# Altium schematic sheet BOOST_REG.SchDoc
size C; SheetNumber: 9; SheetTotal: 15
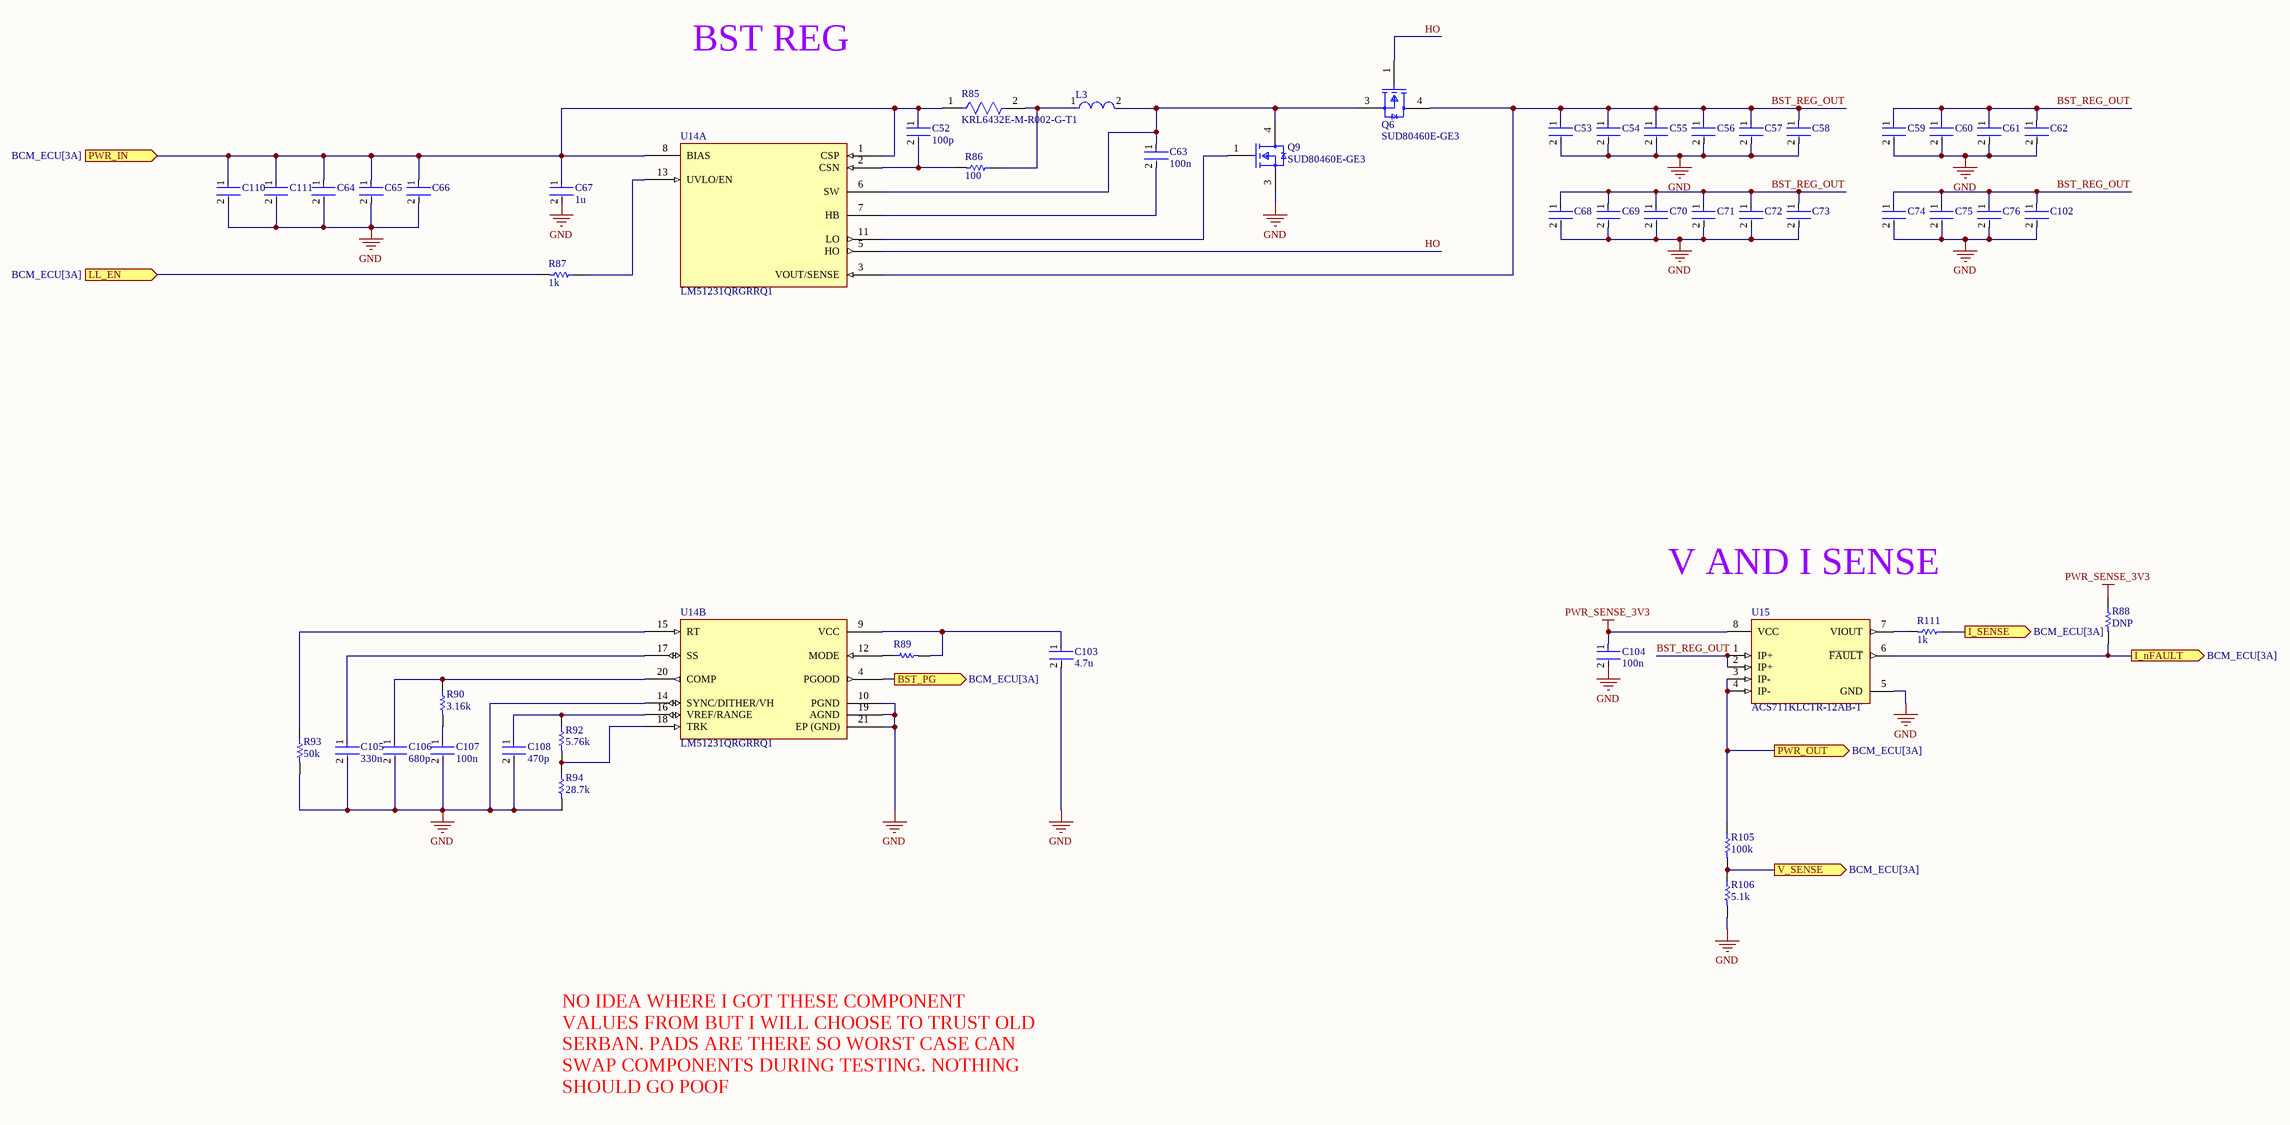
[diagram p0: BOOST_REG.SchDoc]

## Parts
C52  100p  [FP-0402-L_1_0_0_05-W_0_5-IPC_A]
C53  CGA9P3X7S2A156M250KB  [FP-CGA9P-IPC_B]  (value not drawn)
C54  CGA9P3X7S2A156M250KB  [FP-CGA9P-IPC_B]  (value not drawn)
C55  CGA9P3X7S2A156M250KB  [FP-CGA9P-IPC_B]  (value not drawn)
C56  CGA9P3X7S2A156M250KB  [FP-CGA9P-IPC_B]  (value not drawn)
C57  CGA9P3X7S2A156M250KB  [FP-CGA9P-IPC_B]  (value not drawn)
C58  CGA9P3X7S2A156M250KB  [FP-CGA9P-IPC_B]  (value not drawn)
C59  C5750X7R2A335K230KA  [FP-C5750-230-0_4-MFG]  (value not drawn)
C60  C5750X7R2A335K230KA  [FP-C5750-230-0_4-MFG]  (value not drawn)
C61  C5750X7R2A335K230KA  [FP-C5750-230-0_4-MFG]  (value not drawn)
C62  C5750X7R2A335K230KA  [FP-C5750-230-0_4-MFG]  (value not drawn)
C63  100n  [FP-0402-L_1_0_0_05-W_0_5-IPC_A]
C64  CKG57NX5R1H226M500JH  [FP-CKG57N-MFG]  (value not drawn)
C65  CKG57NX5R1H226M500JH  [FP-CKG57N-MFG]  (value not drawn)
C66  HMK325B7105KN-T  [FP-1210-L_3_2_0_3-W_2_5_0-IPC_B]  (value not drawn)
C67  1u  [FP-0402-L_1_0_0_05-W_0_5-IPC_A]
C68  CGA9P3X7S2A156M250KB  [FP-CGA9P-IPC_B]  (value not drawn)
C69  CGA9P3X7S2A156M250KB  [FP-CGA9P-IPC_B]  (value not drawn)
C70  CGA9P3X7S2A156M250KB  [FP-CGA9P-IPC_B]  (value not drawn)
C71  CGA9P3X7S2A156M250KB  [FP-CGA9P-IPC_B]  (value not drawn)
C72  CGA9P3X7S2A156M250KB  [FP-CGA9P-IPC_B]  (value not drawn)
C73  CGA9P3X7S2A156M250KB  [FP-CGA9P-IPC_B]  (value not drawn)
C74  C5750X7R2A335K230KA  [FP-C5750-230-0_4-MFG]  (value not drawn)
C75  C5750X7R2A335K230KA  [FP-C5750-230-0_4-MFG]  (value not drawn)
C76  C5750X7R2A335K230KA  [FP-C5750-230-0_4-MFG]  (value not drawn)
C102  C5750X7R2A335K230KA  [FP-C5750-230-0_4-MFG]  (value not drawn)
C103  4.7u  [FP-0402-L_1_0_0_05-W_0_5-IPC_A]
C104  100n  [FP-0402-L_1_0_0_05-W_0_5-IPC_A]
C105  330n  [FP-0402-L_1_0_0_05-W_0_5-IPC_A]
C106  680p  [FP-0402-L_1_0_0_05-W_0_5-IPC_A]
C107  100n  [FP-0402-L_1_0_0_05-W_0_5-IPC_A]
C108  470p  [FP-0402-L_1_0_0_05-W_0_5-IPC_A]
C110  DNP  [FP-CKG57N-MFG]  (value not drawn)
C111  DNP  [FP-CKG57N-MFG]  (value not drawn)
L3  PM5433.302NLT  [PM5433.302NLT-Footprint-1]  (value not drawn)
Q6  SUD80460E-GE3  [FP-T16-0236-MFG]
Q9  SUD80460E-GE3  [FP-T16-0236-MFG]
R85  KRL6432E-M-R002-G-T1  [FP-KRL6432E-MFG]
R86  100  [R0603B]
R87  1k  [R0603B]
R88  DNP  [R0603B]
R89  0402 JUMPER  [RESC1005X40X25ML05T05]  (value not drawn)
R90  3.16k  [R0603B]
R92  5.76k  [R0603B]
R93  50k  [R0603B]
R94  28.7k  [R0603B]
R105  100k  [R0603B]
R106  5.1k  [R0603B]
R111  1k  [R0603B]
U14  LM51231QRGRRQ1  [QFN50P350X350X100_HS-21N]  (parts A,B of 2)
U15  ACS711KLCTR-12AB-T  [FP-LC-8-IPC_C]

## Ports
BST_PG (out, see BCM_ECU[3A]), I_nFAULT (out, see BCM_ECU[3A]), I_SENSE (out, see BCM_ECU[3A]), LL_EN (in, see BCM_ECU[3A]), PWR_IN (in, see BCM_ECU[3A]), PWR_OUT (out, see BCM_ECU[3A]), V_SENSE (out, see BCM_ECU[3A])

## Nets
GND: C53.2 C54.2 C55.2 C56.2 C57.2 C58.2 C59.2 C60.2 C61.2 C62.2 C64.2 C65.2 C66.2 C67.2 C68.2 C69.2 C70.2 C71.2 C72.2 C73.2 C74.2 C75.2 C76.2 C102.2 C103.2 C104.2 C105.2 C106.2 C107.2 C108.2 C110.2 C111.2 Q9.3(S) R93.2 R94.2 R106.2 U14.10(PGND) U14.14(SYNC/DITHER/VH) U14.19(AGND) U14.21(EP_(GND)) U15.5(GND)
PWR_SENSE_3V3: C104.1 R88.1 U15.8(VCC)
BST_PG: U14.4(PGOOD) ; port BST_PG
BST_REG_OUT: C53.1 C54.1 C55.1 C56.1 C57.1 C58.1 C59.1 C60.1 C61.1 C62.1 C68.1 C69.1 C70.1 C71.1 C72.1 C73.1 C74.1 C75.1 C76.1 C102.1 Q6.4(D) U14.3(VOUT/SENSE) U15.1(IP+) U15.2(IP+)
HO: Q6.1(G) U14.5(HO)
I_nFAULT: R88.2 U15.6(~{FAULT}) ; port I_nFAULT
I_SENSE: R111.1 ; port I_SENSE
LL_EN: R87.2 ; port LL_EN
PWR_IN: C52.1 C64.1 C65.1 C66.1 C67.1 C110.1 C111.1 R85.1 U14.1(CSP) U14.8(BIAS) ; port PWR_IN
PWR_OUT: R105.1 U15.3(IP-) U15.4(IP-) ; port PWR_OUT
V_SENSE: R105.2 R106.1 ; port V_SENSE
NetC52_2: C52.2 R86.2 U14.2(CSN)
NetC63_1: C63.1 L3.2 Q6.3(S) Q9.4(D) U14.6(SW)
NetC63_2: C63.2 U14.7(HB)
NetC103_1: C103.1 R89.2 U14.9(VCC)
NetC105_1: C105.1 U14.17(SS)
NetC106_1: C106.1 R90.1 U14.20(COMP)
NetC107_1: C107.1 R90.2
NetC108_1: C108.1 R92.1 U14.16(VREF/RANGE)
NetL3_1: L3.1 R85.2 R86.1
NetQ9_1: Q9.1(G) U14.11(LO)
NetR87_1: R87.1 U14.13(UVLO/EN)
NetR89_1: R89.1 U14.12(MODE)
NetR92_2: R92.2 R94.1 U14.18(TRK)
NetR93_1: R93.1 U14.15(RT)
NetR111_2: R111.2 U15.7(VIOUT)

## Notes on the sheet
- BST REG
- V AND I SENSE
- NO IDEA WHERE I GOT THESE COMPONENT VALUES FROM BUT I WILL CHOOSE TO TRUST OLD SERBAN. PADS ARE THERE SO WORST CASE CAN SWAP COMPONENTS DURING TESTING. NOTHING SHOULD GO POOF

## Library data of the parts
C52 C63 C67 C103-C108 = CMP-001-00058-1: LARGE PADS, 0402 CAP, CHANGE COMMENT TO MATCH REAL P/N; Capacitor Type: Ceramic; Min Operating Temperature: -55°C; Mounting Technology: Surface Mount; Pins: 2; Case/Package: 0402; RoHS Compliant: Yes; Max Operating Temperature: 85°C
C53-C58 C68-C73 = CMP-2000-07446-2: Cap Ceramic 15uF 100V X7S 20% Pad SMD 2220 +125°C Automotive T/R; Thickness: 0.098inch; Weight: 0.016932oz; Depth: 5mm; Min Operating Temperature: -55°C; Composition: Ceramic; Voltage Rating: 100V; Capacitance: 15uF; Package Quantity: 1; Width: 0.197inch; Max Operating Temperature: 125°C; Voltage Rating (DC): 100V; Case Code (Metric): 5750; Tolerance: 20%; Length: 5.7mm; Height: 2.3mm; Mount: Surface Mount; Dielectric: X7S; Termination: SMD/SMT; Case/Package: 2220; Case Code (Imperial): 2220; Packaging: Tape and Reel; Lead Free: Lead Free; Ratings: AEC-Q200; REACH SVHC: No SVHC
C59-C62 C74-C76 C102 = CMP-08246-004290-1: Multilayer Ceramic Capacitors 3.3uF ±10% 100V X7R SMD 2220; Resistor Type: Ceramic; Voltage Rating: 100V; Termination: SMD/SMT; Length: 5.7mm; Lead Free: Lead Free; Voltage: 100V; Voltage Rating (DC): 100V; Depth: 5mm; Width: 5mm; Case Code (Imperial): 2220; Tolerance: 10%; Mount: Surface Mount; Package Quantity: 1; RoHS Compliant: Yes; Thickness: 0.098inch; Min Operating Temperature: -55°C; Packaging: Tape and Reel; Case Code (Metric): 5750; Number of Pins: 2; Dielectric: X7R; Weight: 0.016932oz; Max Operating Temperature: 125°C; Capacitance: 3.3uF; Case/Package: 2220; Series: C; Height: 2.3mm
C64 C65 C110 C111 = CMP-08246-005087-1: CAP CER 22UF 50V X5R SMD; Lead/Base Style: L-Lead; Tolerance: 20%; Case Code (Imperial): 2220; Length: 6mm; Packaging: Tape and Reel; Thickness: 0.217inch; Min Operating Temperature: -55°C; Max Operating Temperature: 85°C; Voltage: 50V; Series: CKG; REACH SVHC: No SVHC; Height: 5mm; Dielectric: X5R; RoHS Compliant: Yes; Radiation Hardening: No; Capacitance: 22uF; Package Quantity: 1; Voltage Rating: 50V; Width: 5mm; Voltage Rating (DC): 50V; Number of Pins: 2; Case Code (Metric): 5750; Termination: Metal; Mount: Surface Mount; Case/Package: Ceramic; Lead Free: Lead Free; Depth: 5mm; Resistor Type: Ceramic
C66 = CMP-14477-002774-2: None; Dielectric: X5R; Capacitance: 1uF; Voltage Rating (DC): 100V; Tolerance: 10%; Length: 3.2mm; Thickness: 0.083inch; Construction: Flat; Width: 2.5mm; Number of Pins: 2; Height: 1.9mm; REACH SVHC: No SVHC; Case Code (Metric): 3225; Termination: SMD/SMT; Packaging: Tape and Reel; Resistor Type: Ceramic; Mount: Surface Mount; Radiation Hardening: No; Case/Package: 1210; Case Code (Imperial): 1210; Min Operating Temperature: -55°C; Max Operating Temperature: 125°C; Halogen Free: Halogen Free; Voltage Rating: 100V; Depth: 2.5mm; Package Quantity: 1; RoHS Compliant: Yes; Voltage: 100V; Series: M
L3 = CMP-006-00032-1: High Current Composite Inductor - PA5433.XXXNLT and PM5433.XXXNLT
Q6 Q9 = CMP-02550-000179-1: MOSFET N-CH 150V 42A TO252AA; Manufacturer: Vishay; Rthja Max: 50°C/W; Number Of N Channels: 1; Max Junction Temp: +175°C; Power Dissipation: 65.2W; Reverse Recovery Charge: 210nC; Reverse Recovery Time: 68ns; Threshold Vgs Max: 4V; Input Capacitace At Vds: 560pF @ 50V; Drain To Source Resistance: 0.0372Ω; Max Forward Diode Voltage: 1.5V; Gate Charge At Vgs: 10.5nC @ 10V; Threshold Vgs Min: 2V; Transconductance: 11S; Typ Forward Diode Voltage: 0.85V; Turn On Delay Time: 8ns; Turn Off Delay Time: 15ns; Gate To Source Voltage: 20V; Depletion Mode: False; Pulse Drain Current: 40A; Automotive: No; Drain To Source Voltage: 150V; ComponentLink2Description: Datasheet; Octopart: https://octopart.com/sud80460e-ge3-vishay-78440626; Device Class L2: Transistors; Lead Free: Yes; Device Class L3: MOSFETs; Temperature Range High: +175°C; Continuous Drain Current: 42A; Temperature: -55°C to +175°C; Footprint Url: https://www.vishay.com/docs/71197/to252aa.pdf; Manufacturer Part Number: SUD80460E-GE3; Package: T16-0236; ComponentLink2URL: https://www.vishay.com/docs/76248/sud80460e.pdf; Device Class L1: Discrete Semiconductors; Digikey Description: MOSFET N-CH 150V 42A TO252AA; Number Of Channels: 1; Category: Trans; Temperature Range Low: -55°C; Height: 2.507mm; RoHS: TRUE; Drain To Source Breakdown Voltage: 150V
R85 = CMP-00597-24927455-1: KRL6432E-M-R002-G-T1 Metal Foil Low Resistance Chip Resistor (long-side terminal), 2512, RoHS; Power Rating: 3W; Tolerance: 2%; Resistance: 2mΩ; Temperature Coefficient: 100ppm/°C; Width: 6.3mm; Termination: SMD/SMT; Weight: 40.511469mg; RoHS: Compliant; Lifecycle Status: Production; Case Code (Imperial): 2512; Case Code (Metric): 6432; Case/Package: 2512; Height: 700µm; Length: 3.1mm; Max Thickness: 700µm; Min Operating Temperature: -55°C; NexarPartId: 24927455; Composition: Metal Foil; Max Operating Temperature: 155°C
R86-R88 R90 R92-R94 R105 R106 = CMP-009-00002-14: Resistor; Value: 330
R89 = CMP-009-00118-2: READ THE NAME; Pins: 2; Component Type: Standard; Design Item ID: CMP-009-00206-2; Source: 0402jump.SchLib
R111 = CMP-009-00002-14: Resistor; Value: 1k
U14 = CMP-019-00051-1: 2.2-MHz wide-VIN, synchronous boost controller with output voltage tracking 20-VQFN -40 to 125
U15 = CMP-1557-00012-2: SENSOR CURRENT HALL 12.5A AC/DC; Number of Channels: 1; Min Supply Voltage: 3V; Sensitivity: 110mV/A; Response Time: 4.6us; Operating Supply Voltage: 3.3V; Max Supply Voltage: 5.5V; Max Supply Current: 5.5mA; Bandwidth: 100kHz; Linearity: 1%; Quiescent Current: 4mA; Accuracy: 5%; Polarity: Bidirectional; Case/Package: SOIC; Packaging: Tape and Reel; Number of Pins: 8; Width: 3.9mm; Frequency: 100kHz; -3db Bandwidth: 100kHz; REACH SVHC: No SVHC; Series: -; Height: 1.5mm; Package Quantity: 1; Min Operating Temperature: -40°C; Max Operating Temperature: 125°C; Current Sensing: 12.5A; RoHS Compliant: Yes; Length: 4.9mm